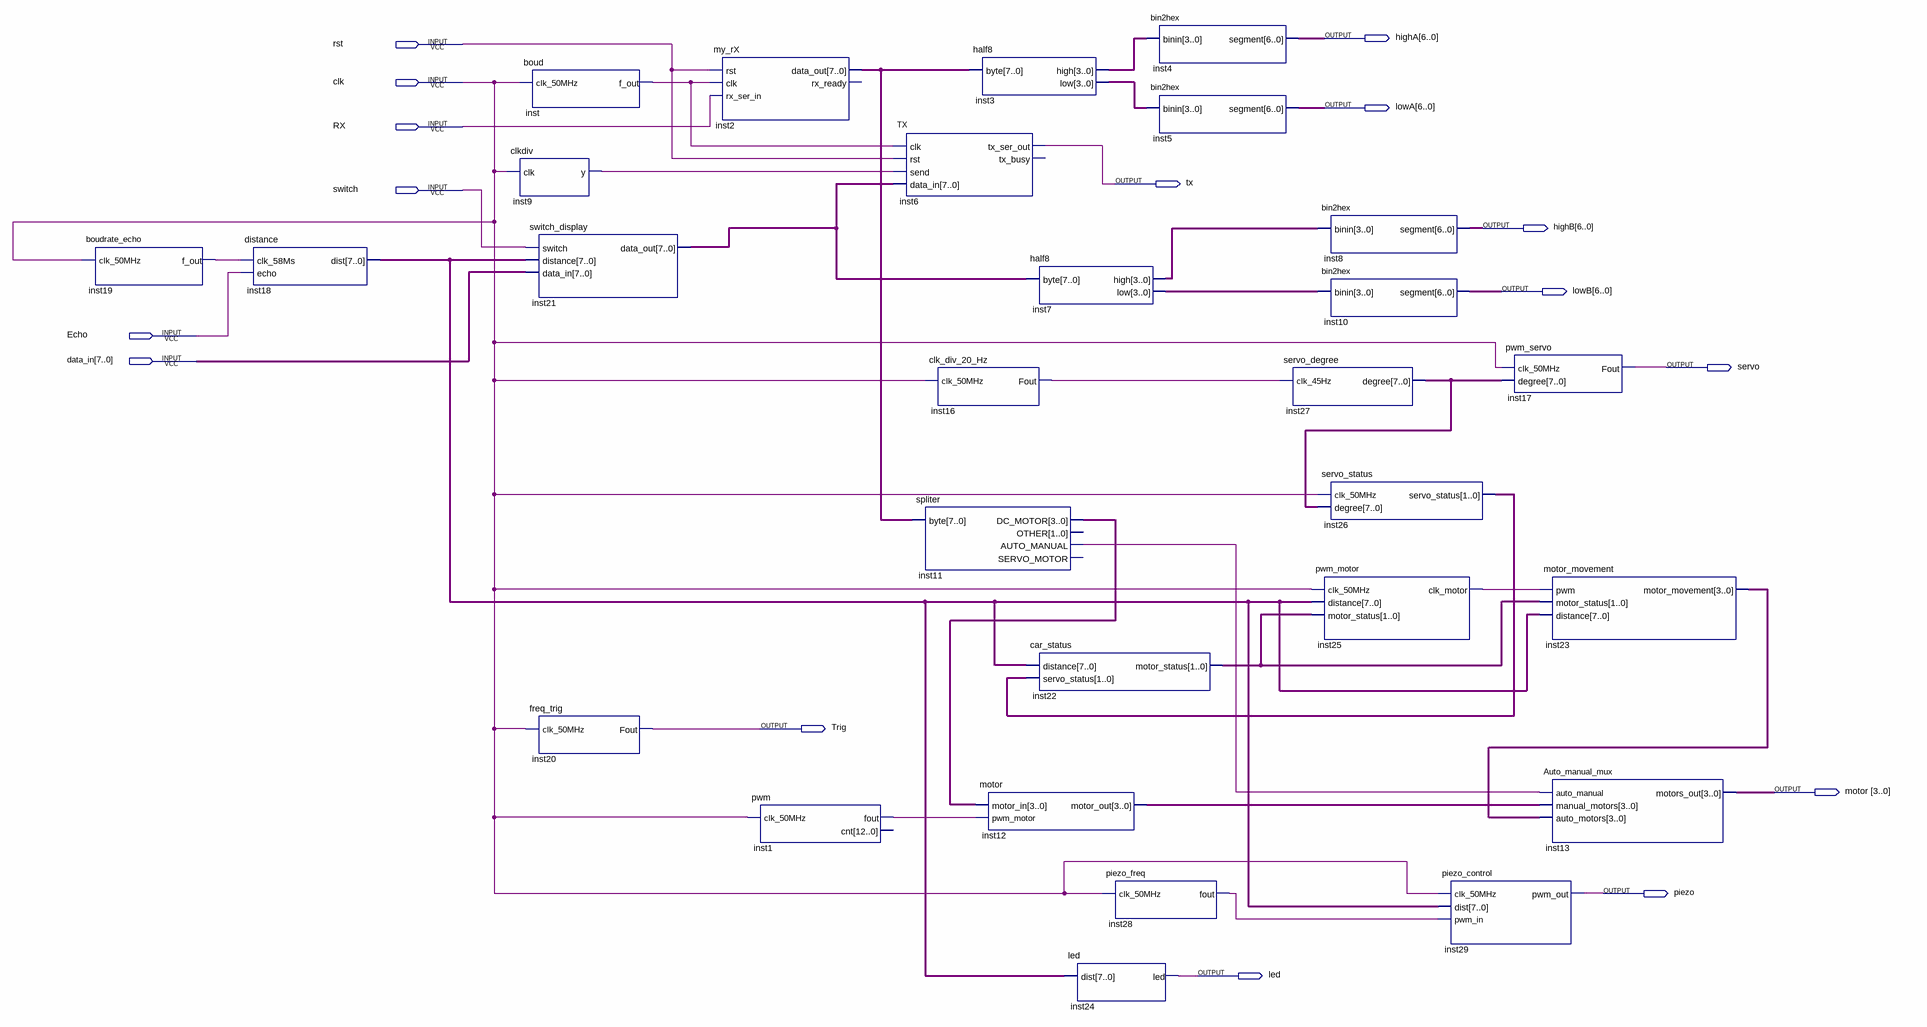
[diagram p0: schematic sheet]
// Quartus schematic rxtx.bdf as structural Verilog: 28 symbols, 16 pins
module rxtx (
  input  rst,
  input  clk,
  input  RX,
  input  switch,
  input  Echo,
  input  [7:0] data_in,
  output [6:0] highA,
  output [6:0] lowA,
  output tx,
  output [6:0] highB,
  output [6:0] lowB,
  output servo,
  output Trig,
  output [3:0] motor,
  output piezo,
  output led
);

  wire inst1_fout, inst9_y, inst11_auto_manual, inst16_fout, inst19_f_out, inst25_clk_motor, inst28_fout,
       inst_f_out;
  wire [1:0] inst22_motor_status, inst26_servo_status;
  wire [3:0] inst3_high, inst3_low, inst7_high, inst7_low, inst11_dc_motor, inst12_motor_out,
       inst23_motor_movement;
  wire [7:0] inst2_data_out, inst18_dist, inst21_data_out, inst27_degree;

  boudrate_echo inst19 (.clk_50MHz(clk), .f_out(inst19_f_out));
  distance inst18 (.clk_58Ms(inst19_f_out), .echo(Echo), .\dist (inst18_dist));
  boud inst (.clk_50MHz(clk), .f_out(inst_f_out));
  clkdiv inst9 (.clk(clk), .y(inst9_y));
  switch_display inst21 (.switch(switch), .distance(inst18_dist), .data_in(data_in), .data_out(inst21_data_out));
  freq_trig inst20 (.clk_50MHz(clk), .Fout(Trig));
  my_rX inst2 (.rst(rst), .clk(inst_f_out), .rx_ser_in(RX), .data_out(inst2_data_out));  // open: rx_ready
  pwm inst1 (.clk_50MHz(clk), .fout(inst1_fout));  // open: cnt
  TX inst6 (.clk(inst_f_out), .rst(rst), .send(inst9_y), .data_in(inst21_data_out), .tx_ser_out(tx));  // open: tx_busy
  clk_div_20_Hz inst16 (.clk_50MHz(clk), .Fout(inst16_fout));
  spliter inst11 (
    .\byte (inst2_data_out), .DC_MOTOR(inst11_dc_motor), .AUTO_MANUAL(inst11_auto_manual));  // open: OTHER, SERVO_MOTOR
  half8 inst3 (.\byte (inst2_data_out), .high(inst3_high), .low(inst3_low));
  motor inst12 (.motor_in(inst11_dc_motor), .pwm_motor(inst1_fout), .motor_out(inst12_motor_out));
  half8 inst7 (.\byte (inst21_data_out), .high(inst7_high), .low(inst7_low));
  car_status inst22 (.distance(inst18_dist), .servo_status(inst26_servo_status), .motor_status(inst22_motor_status));
  led inst24 (.\dist (inst18_dist), .led(led));
  piezo_freq inst28 (.clk_50MHz(clk), .fout(inst28_fout));
  bin2hex inst4 (.binin(inst3_high), .segment(highA));
  bin2hex inst5 (.binin(inst3_low), .segment(lowA));
  servo_degree inst27 (.clk_45Hz(inst16_fout), .degree(inst27_degree));
  bin2hex inst8 (.binin(inst7_high), .segment(highB));
  bin2hex inst10 (.binin(inst7_low), .segment(lowB));
  servo_status inst26 (.clk_50MHz(clk), .degree(inst27_degree), .servo_status(inst26_servo_status));
  pwm_motor inst25 (
    .clk_50MHz(clk), .distance(inst18_dist), .motor_status(inst22_motor_status), .clk_motor(inst25_clk_motor));
  piezo_control inst29 (.clk_50MHz(clk), .\dist (inst18_dist), .pwm_in(inst28_fout), .pwm_out(piezo));
  pwm_servo inst17 (.clk_50MHz(clk), .degree(inst27_degree), .Fout(servo));
  motor_movement inst23 (
    .pwm(inst25_clk_motor), .motor_status(inst22_motor_status), .distance(inst18_dist),
    .motor_movement(inst23_motor_movement));
  Auto_manual_mux inst13 (
    .auto_manual(inst11_auto_manual), .manual_motors(inst12_motor_out), .auto_motors(inst23_motor_movement),
    .motors_out(motor));
endmodule
